# EAGLE design led strip v3 (EAGLE 8.4.3)
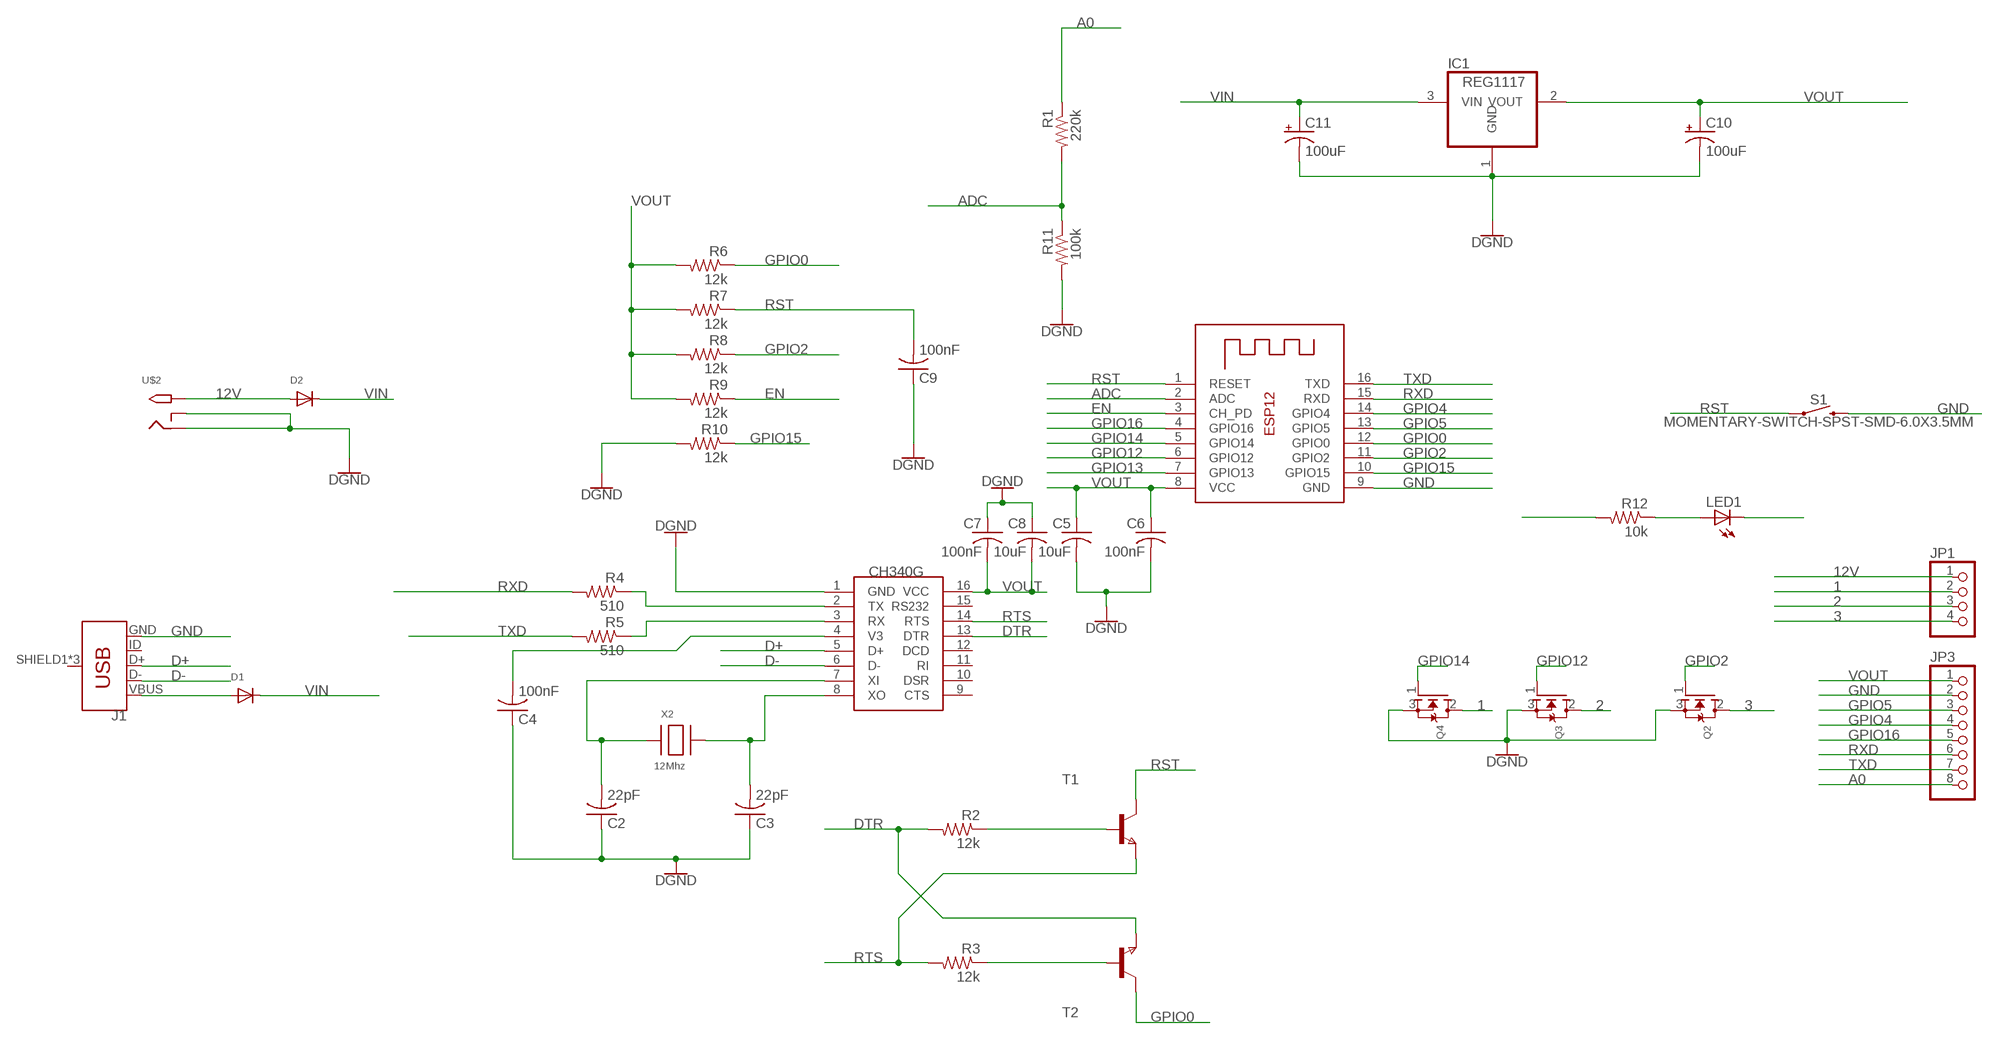
[diagram p0: schematic, sheet 1]

## Parts
C2  22pF  C-USC0805  [C0805]
C3  22pF  C-USC0805  [C0805]
C4  100nF  C-USC0805  [C0805]
C5  10uF  C-USC0805  [C0805]
C6  100nF  C-USC0805  [C0805]
C7  100nF  C-USC0805  [C0805]
C8  10uF  C-USC0805  [C0805]
C9  100nF  C-USC0805  [C0805]
C10  100uF  CPOL-USCT7343  [CT7343]
C11  100uF  CPOL-USCT7343  [CT7343]
D1  DIODESOD-123  [SOD-123]
D2  DIODESOD-123  [SOD-123]
IC1  REG1117  [SOT223]
J1  USB_MICRO-B_FEMALE-SMT  [USB-B-MICRO-SMD]
JP1  PINHD-1X4  [1X04]
JP3  PINHD-1X8  [1X08]
LED1  LEDCHIP-LED0603  [CHIP-LED0603]
Q2  MOSFET-NGDS_TO220V  [TO220V]
Q3  MOSFET-NGDS_TO220V  [TO220V]
Q4  MOSFET-NGDS_TO220V  [TO220V]
R1  220k  R-US_R0805  [R0805]
R2  12k  R-US_R0805  [R0805]
R3  12k  R-US_R0805  [R0805]
R4  510  R-US_R0805  [R0805]
R5  510  R-US_R0805  [R0805]
R6  12k  R-US_R0805  [R0805]
R7  12k  R-US_R0805  [R0805]
R8  12k  R-US_R0805  [R0805]
R9  12k  R-US_R0805  [R0805]
R10  12k  R-US_R0805  [R0805]
R11  100k  R-US_R0805  [R0805]
R12  10k  R-US_R0805  [R0805]
S1  MOMENTARY-SWITCH-SPST-SMD-6.0X3.5MM  [TACTILE_SWITCH_SMD_6.0X3.5MM]
T1  NPNSOT23  [SOT-23]
T2  NPNSOT23  [SOT-23]
U$1  CH340G  [SOIC16]
U$2  2.1MMJACKTHM  [PJ-102A]
X1  ESP-12  [ESP-12]
X2  12Mhz  XTALNX5032  [NX5032]

## Nets
1: JP1.2 Q4.2(D)
2: JP1.3 Q3.2(D)
3: JP1.4 Q2.2(D)
12V: D2.A JP1.1 U$2.TIP
A0: JP3.8 R1.1
ADC: R1.2 R11.1 X1.2(ADC)
D+: J1.D+ U$1.5(D+)
D-: J1.D- U$1.6(D-)
DTR: R2.2 T2.2(E) U$1.13(DTR)
EN: R9.1 X1.3(CH_PD)
GND: C2.1 C3.1 C4.1 C5.2 C6.2 C7.1 C8.1 C9.1 C10.- C11.- IC1.1(GND) J1.GND JP3.2 LED1.C Q2.3(S) Q3.3(S) Q4.3(S) R10.2 R11.2 S1.2 U$1.1(GND) U$2.RING U$2.RING_SW X1.9(GND) ; supply symbol labelled DGND
GPIO0: R6.1 T2.1(C) X1.12(GPIO0)
GPIO2: Q2.1(G) R8.1 X1.11(GPIO2)
GPIO4: JP3.4 X1.14(GPIO4)
GPIO5: JP3.3 X1.13(GPIO5)
GPIO12: Q3.1(G) X1.6(GPIO12)
GPIO13: X1.7(GPIO13)
GPIO14: Q4.1(G) X1.5(GPIO14)
GPIO15: R10.1 X1.10(GPIO15)
GPIO16: JP3.5 X1.4(GPIO16)
N$1: R2.1 T1.3(B)
N$2: R3.1 T2.3(B)
N$3: D1.A J1.VBUS
N$4: LED1.A R12.1
N$5: C2.2 U$1.7(XI) X2.P$1
N$6: C3.2 U$1.8(XO) X2.P$2
N$28: R4.1 U$1.2(TX)
N$29: R5.1 U$1.3(RX)
N$30: C4.2 U$1.4(V3)
RST: C9.2 R7.1 S1.1 T1.1(C) X1.1(RESET)
RTS: R3.2 T1.2(E) U$1.14(RTS)
RXD: JP3.6 R4.2 X1.15(RXD)
TXD: JP3.7 R5.2 X1.16(TXD)
VIN: C11.+ D1.C D2.C IC1.3(VIN)
VOUT: C5.1 C6.1 C7.2 C8.2 C10.+ IC1.2(VOUT) JP3.1 R6.2 R7.2 R8.2 R9.2 R12.2 U$1.16(VCC) X1.8(VCC)
Unconnected: J1.ID J1.SHIELD1(SHIELD) J1.SHIELD2(SHIELD) J1.SHIELD3(SHIELD) U$1.9(CTS) U$1.10(DSR) U$1.11(RI) U$1.12(DCD) U$1.15(RS232)

## Library data of the parts
C2-C9 = adafruit:C-US: CAPACITOR, American symbol
C10 C11 = adafruit:CPOL-US: POLARIZED CAPACITOR, American symbol
D1 D2 = adafruit:DIODE: Diode SMADIODE - SMA Surface Mount Package 20V 1A Schottky Diode Digikey: 641-1014-6-ND DO-1N4148 - Through Hole Small Current Diode SOD-123 20V 1 A (.5mV Vf) Schottky Diode - Digikey: MBRX120TPMSCT-ND SOD-323 10V 570mA (.38mV Vf, 3ns) Schottky Diode - Digikey: ZLLS410CT-ND SOD-523 30V 30mA Schottky Diode (RB751S-40TE61) - Digikey: RB751S-40TE61CT-ND SOT23-R/W - SOT23 Package (R = Solder Paste/Reflow Ovens, W = Hand-Soldering) BAT54Film 40V 300mA - Digikey: 497-7162-1-ND
IC1 = burr-brown:REG1117: 800mA and 1A Low Dropout (LDO) Positive Regulator 1.8V, 2.5V, 2.85V, 3.3V, 5V, and Adj; MPN: REG1117; OC_FARNELL: 1097566; OC_NEWARK: 14P6981
J1 = SparkFun-Connectors:USB_MICRO-B: USB Type Micro-B Connector Male/female and PTH/SMT variants SparkFun Products: SparkFun microB USB Breakout <https://www.sparkfun.com/products/12035> SparkFun USB microB Plug Breakout <https://www.sparkfun.com/products/10031> SparkFun ESP8266 Thing <https://www.sparkfun.com/products/13231>; PROD_ID: CONN-11752
JP1 = pinhead:PINHD-1X4: PIN HEADER
JP3 = pinhead:PINHD-1X8: PIN HEADER
LED1 = adafruit:LED: LED OSRAM: - CHIPLED LG R971, LG N971, LY N971, LG Q971, LY Q971, LO R971, LY R971 LH N974, LH R974 LS Q976, LO Q976, LY Q976 LO Q996 - Hyper CHIPLED LW Q18S LB Q993, LB Q99A, LB R99A - SideLED LS A670, LO A670, LY A670, LG A670, LP A670 LB A673, LV A673, LT A673, LW A673 LH A674 LY A675 LS A676, LA A676, LO A676, LY A676, LW A676 LS A679, LY A679, LG A679 - Hyper Micro SIDELED® LS Y876, LA Y876, LO Y876, LY Y876 LT Y87S - SmartLED LW L88C, LW L88S LB L89C, LB L89S, LG L890 LS L89K, LO L89K, LY L89K LS L896, LA L896, LO L896, LY L896 - TOPLED LS T670, LO T670, LY T670, LG T670, LP T670 LSG T670, LSP T670, LSY T670, LOP T670, LYG T670 LG T671, LOG T671, LSG T671 LB T673, LV T673, LT T673, LW T673 LH T674 LS T676, LA T676, LO T676, LY T676, LB T676, LH T676, LSB T676, LW T676 LB T67C, LV T67C, LT T67C, LS T67K, LO T67K, LY T67K, LW E67C LS E67B, LA E67B, LO E67B, LY E67B, LB E67C, LV E67C, LT E67C LW T67C LS T679, LY T679, LG T679 LS T770, LO T770, LY T770, LG T770, LP T770 LB T773, LV T773, LT T773, LW T773 LH T774 LS E675, LA E675, LY E675, LS T675 LS T776, LA T776, LO T776, LY T776, LB T776 LHGB T686 LT T68C, LB T68C - Hyper Mini TOPLED® LB M676 - Mini TOPLED Santana® LG M470 LS M47K, LO M47K, LY M47K Source: http://www.osram.convergy.de/
Q2-Q4 = adafruit:MOSFET-N: N-Channel Mosfet 2N7002E - 60V 260mA SOT23 [Digikey: 2N7002ET1GOSTR-ND] - REEL BSH103 - 30V 850mA SOT23 [Digikey: 568-5013-1-ND]
R1-R12 = adafruit:R-US_: RESISTOR, American symbol
S1 = SparkFun-Switches:MOMENTARY-SWITCH-SPST: Momentary Switch (Pushbutton) - SPST Normally-open (NO) SPST momentary switches (buttons, pushbuttons). Variants PTH-12MM - 12mm square, through-hole Momentary Pushbutton Switch - 12mm Square <https://www.sparkfun.com/products/9190> (COM-09190) PTH-6.0MM, PTH-6.0MM-KIT - 6.0mm square, through-hole Mini Pushbutton Switch <https://www.sparkfun.com/products/97> (COM-00097) KIT package intended for soldering kit's - only one side of pads' copper is exposed. PTH-RIGHT-ANGLE-KIT - Right-angle, through-hole Right Angle Tactile Button <https://www.sparkfun.com/products/10791> - Used on SparkFun BigTime Watch Kit <https://www.sparkfun.com/products/11734> SMD-12MM - 12mm square, surface-mount Tactile Button - SMD (12mm) <https://www.sparkfun.com/products/12993> (COM-12993) Used on SparkFun PicoBoard <https://www.sparkfun.com/products/11888> SMD-4.5MM - 4.5mm Square Trackball Switch Used on SparkFun Blackberry Trackballer Breakout <https://www.sparkfun.com/products/13169> SMD-4.6MMX2.8MM - 4.60mm x 2.80mm, surface mount Used on SparkFun SAMD21 Mini Breakout <https://www.sparkfun.com/products/13664> SMD-5.2MM, SMD-5.2-REDUNDANT - 5.2mm square, surface-mount Mini Pushbutton Switch - SMD <https://www.sparkfun.com/products/8720> (COM-08720) Used on Arduino Pro Mini <https://www.sparkfun.com/products/11114> REDUNDANT package connects both switch circuits together SMD-6.0X3.5MM - 6.0 x 3.5mm, surface mount Momentary Reset Switch SMD <https://www.sparkfun.com/products/8229> (COM-08229) SMD-6.2MM-TALL - 6.2mm square, surface mount Tactile Button - SMD (6mm) <https://www.sparkfun.com/products/12992> Used on SparkFun Digital Sandbox <https://www.sparkfun.com/products/12651> SMD-RIGHT-ANGLE - Right-angle, surface mount Used on SparkFun Block for Intel® Edison - Arduino <https://www.sparkfun.com/products/13036>; PROD_ID: SWCH-00815; SF_SKU: COM-08229
T1 T2 = zetex:NPNSOT23: NPN TRANSISTOR; MPN: DSS20201L-7; OC_FARNELL: 1710688; OC_NEWARK: 25R4555
U$1 = ch340g:CH340G
U$2 = adafruit:2.1MMJACK: 2.1mm x 5.5mm THM DC jack with internal switch. Digikey part #PJ-102A, 4UCON part #05537 2.1mm x 5.5mm SMT DC jack with internal switch. Digikey part #PJ-002A-SMT, 4UCON part #03267 By microbuilder.eu & adafruit.com
X1 = adafruit:ESP-12
X2 = adafruit:XTAL: Low cost SMT crystals, no capacitors included http://www.ladyada.net/library/eagle

## Board
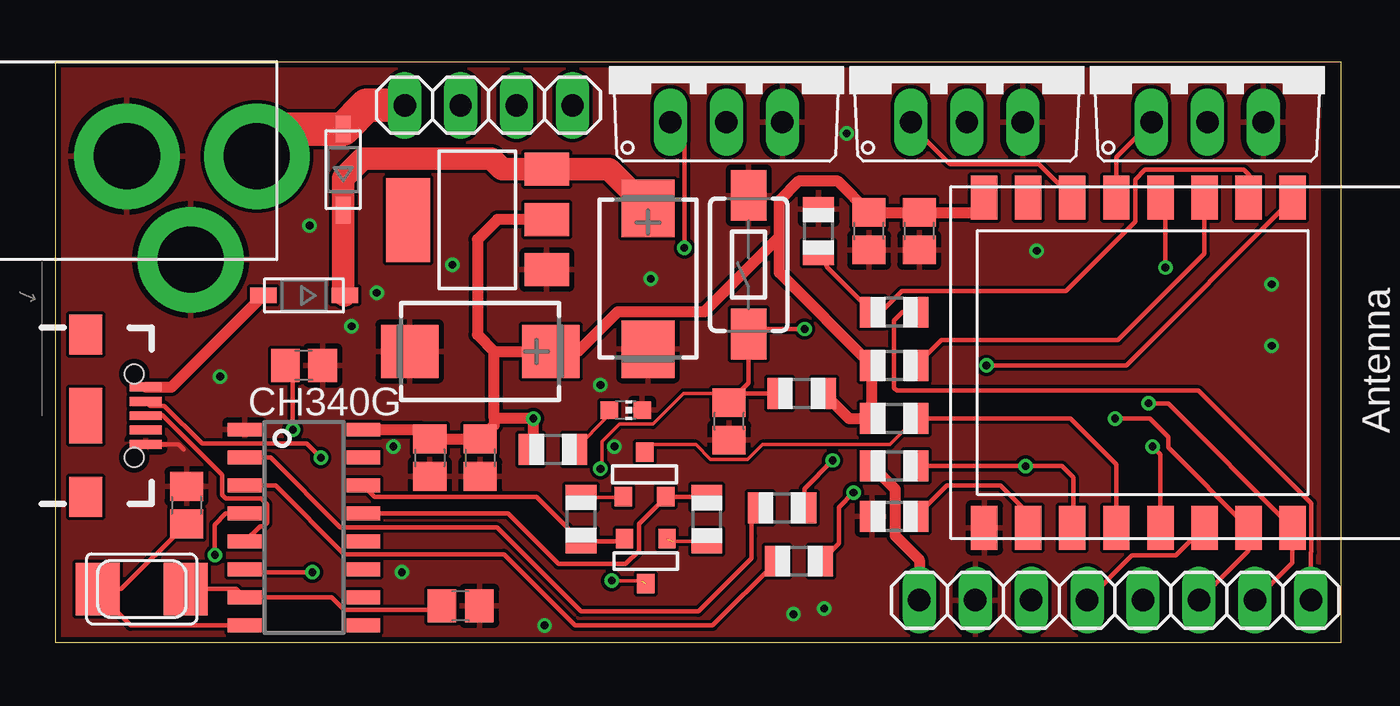
[diagram p1: board, top side]
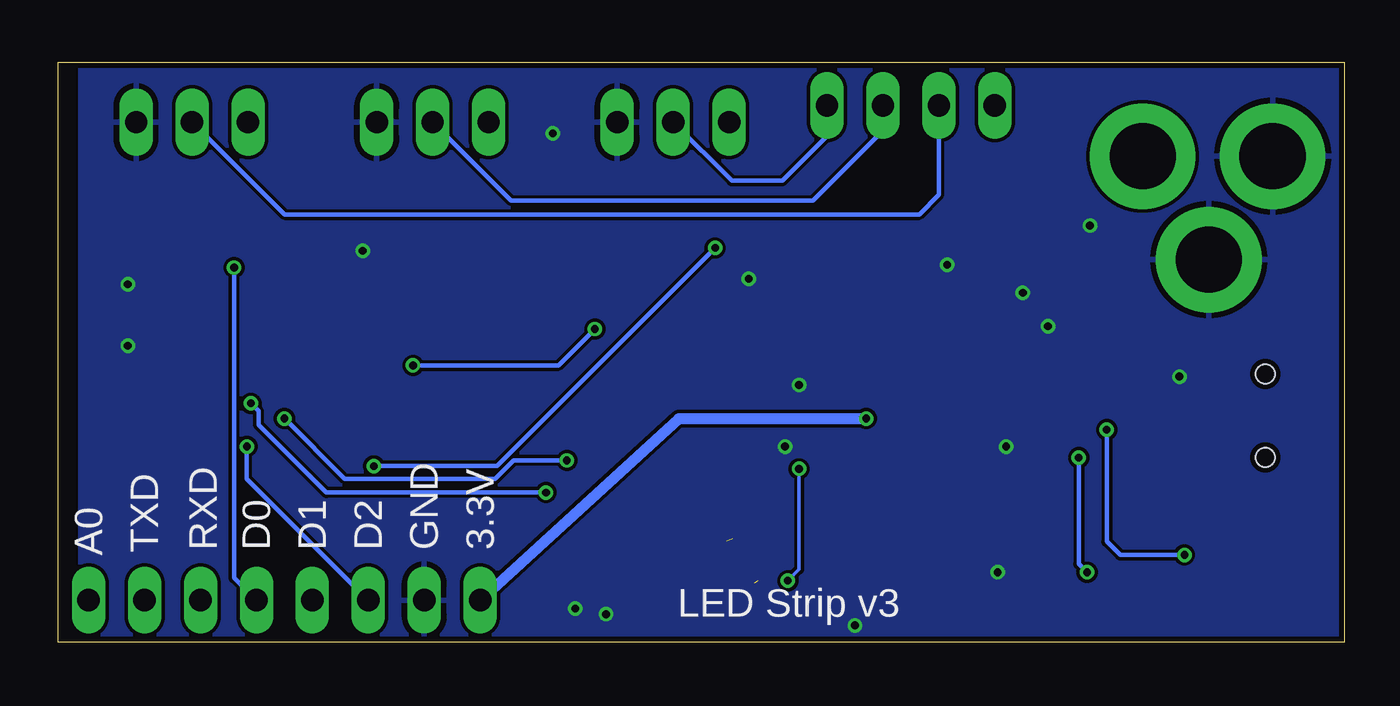
[diagram p2: board, bottom side, seen from below]

Size 58.4 x 26.34 mm. Coordinates in mm from the lower left corner, seen from the top.
Outline: 0,0 58.4,0 58.4,26.34 0,26.34 0,0
Copper layers (1*16): Top 0.035mm / dielectric 1.5mm / Bottom 0.035mm
Design rules "SeeedStudio_2layer_DRU_no_angle_20140221": minimum track width 6mil, minimum drill 12mil, track to track 6mil, track to pad 6mil, pad to pad 6mil, via to via 6mil, smd to smd 0mil, copper to edge 10mil, drill to drill 10mil, minimum pad ring 10mil, minimum via ring 6mil, stop-mask expansion 2mil, vias tented up to drill 100mil, thermal gap 10mil

### Footprints (pad centres in the part's own frame; a part is rotated, then mirrored left to right if it is on the bottom)
C0805 = smd 1.3 x 1.5: 1 -0.85,0; 2 0.85,0
CT7343 = smd 2.6 x 2.4: + 3.2,0; - -3.2,0
SOD-123 = smd 1.2 x 0.7: A 1.85,0; C -1.85,0
SOT223 = smd 1.499 x 2.007: 1 -2.261,-3.15; 2 0.025,-3.15; 3 2.311,-3.15 | smd 3.81 x 2.007: 4 0,3.15
USB-B-MICRO-SMD = smd 1.45 x 0.4: D+ 2.725,0; D- 2.725,0.65; GND 2.725,-1.3; ID 2.725,-0.65; VBUS 2.725,1.3 | smd 1.5 x 1.8: SHIELD1 0,3.685; SHIELD2 0,-3.685 | smd 1.5 x 2.5: SHIELD3 0,0 | hole 0.85: 2.2,1.9; 2.2,-1.9
1X04 = drill 1.016 long: 1 -3.81,0; 2 -1.27,0; 3 1.27,0; 4 3.81,0
1X08 = drill 1.016 long: 1 -8.89,0; 2 -6.35,0; 3 -3.81,0; 4 -1.27,0; 5 1.27,0; 6 3.81,0; 7 6.35,0; 8 8.89,0
CHIP-LED0603 = smd 0.8 x 0.8: A 0,-0.75; C 0,0.75
TO220V = drill 1.016 long: 1 -2.54,-2.54; 2 0,-2.54; 3 2.54,-2.54
R0805 = smd 1.1 x 1.4: 1 -1,0; 2 1,0
TACTILE_SWITCH_SMD_6.0X3.5MM = smd 2.3 x 1.6: 1 -3.15,0; 2 3.15,0
SOT-23 = smd 0.787 x 0.889: 1 0.025,-1.016; 2 -0.94,1.016; 3 0.991,1.016
SOIC16 = smd 0.635 x 1.524: 1 -4.445,-2.695; 2 -3.175,-2.695; 3 -1.905,-2.695; 4 -0.635,-2.695; 5 0.635,-2.695; 6 1.905,-2.695; 7 3.175,-2.695; 8 4.445,-2.695; 9 4.445,2.695; 10 3.175,2.695; 11 1.905,2.695; 12 0.635,2.695; 13 -0.635,2.695; 14 -1.905,2.695; 15 -3.175,2.695; 16 -4.445,2.695
PJ-102A = drill 3 pad 4.8: RING 0.1,-3.39; RING_SW -4.6,-6.29; TIP 0.1,-9.29
ESP-12 = smd 2 x 1.2: 1 -7.5,4.5; 2 -7.5,2.5; 3 -7.5,0.5; 4 -7.5,-1.5; 5 -7.5,-3.5; 6 -7.5,-5.5; 7 -7.5,-7.5; 8 -7.5,-9.5; 9 7.5,-9.5; 10 7.5,-7.5; 11 7.5,-5.5; 12 7.5,-3.5; 13 7.5,-1.5; 14 7.5,0.5; 15 7.5,2.5; 16 7.5,4.5
NX5032 = smd 2 x 2.4: P$1 2,0; P$2 -2,0

### Placement (x,y rotation side)
C2  18.41,1.65 180 top
C3  5.97,6.22 270 top
C4  11.3,12.57 180 top
C5  19.3,8.38 270 top
C6  17.02,8.38 270 top
C7  39.24,18.67 90 top
C8  36.96,18.67 90 top
C9  30.61,10.03 90 top
C10  19.3,13.21 0 top
C11  26.92,16.51 90 top
D1  11.3,15.75 180 top
D2  13.08,21.46 90 top
IC1  19.18,19.18 90 top
J1  1.4,10.29 0 top
JP1  19.68,24.38 0 top
JP3  48.13,1.91 0 top
LED1  25.91,10.54 270 top
Q2  30.48,26.16 0 top
Q3  41.4,26.16 0 top
Q4  52.32,26.16 0 top
R1  38.1,14.99 180 top
R2  29.59,5.59 90 top
R3  23.88,5.59 270 top
R4  33.02,6.1 0 top
R5  33.78,3.68 0 top
R6  38.1,10.16 180 top
R7  33.91,11.3 0 top
R8  38.1,8 180 top
R9  38.1,12.57 180 top
R10  38.1,5.71 180 top
R11  34.67,18.67 90 top
R12  22.61,8.76 180 top
S1  31.5,17.14 90 top
T1  26.8,3.68 0 top
T2  26.8,7.62 180 top
U$1  11.3,5.21 270 top
U$2  -0.13,21.97 90 top
X1  51.69,12.7 270 top
X2  3.94,2.41 0 top

### Tracks (layer width: path | path; a pad name or v marks a point on that pad's centre or on a via)
1
  Bottom 0.203: Q4.2 48.13,19.43 19.3,19.43 18.41,20.32 JP1.2
2
  Bottom 0.203: Q3.2 37.85,20.07 24.13,20.07 20.95,23.24 JP1.3
3
  Bottom 0.203: Q2.2 27.81,20.95 25.53,20.95 23.5,22.99 JP1.4
12V
  Top 1.524: U$2.TIP 10.4,23.31 D2.A 14.15,24.38 JP1.1
A0
  Top 0.203: JP3.8 57.02,4.08 57.04,4.09 57.04,6.3 51.92,11.43 38.23,11.43 38.1,11.56 38.1,14.61 38.48,14.99 R1.1
ADC
  Top 0.203: R11.1 35.05,17.03 R1.2 37.49,14.99 38.45,15.94 45.89,15.94 49.04,19.09 49.04,21.01 49.48,21.45 53.98,21.45 54.23,21.21 54.23,20.24 X1.2
D+
  Top 0.203: U$1.5 9.31,5.27 9.47,5.27 9.62,5.42 9.62,6.26 9.35,6.54 7.74,6.54 7.59,6.69 7.59,7.6 4.87,10.33 4.16,10.33 J1.D+
D-  (via drill 0.35)
  Top 0.203: J1.D- 4.32,10.74 4.95,10.74 6.68,9.02 11.43,9.02 v12.06,8.38 | v11.68,3.17 8.73,3.17 U$1.6
  Bottom 0.203: v11.68,3.17 12.06,3.56 v12.06,8.38
DTR
  Top 0.203: U$1.13 20.57,5.84 22.86,3.56 25.91,3.56 26.5,4.15 26.5,5.37 T2.2 29.57,6.6 R2.2
EN
  Top 0.203: R9.1 40.24,13.72 48.26,13.72 52.19,17.64 X1.3
GND  (via drill 0.35)
  Top 0.203: J1.GND 5.62,8.99 5.84,8.76
  other vias: 13.46,14.35 15.37,8.89 15.75,3.17 33.53,1.27 22.23,0.76 24.77,11.68 25.4,8.89 27.05,16.51 14.61,15.88 55.24,16.26 55.24,13.46 34.92,1.52 18.03,17.14 7.49,12.06 11.56,18.92 35.94,23.11 44.58,17.78
  pour Bottom: -8.38,31.5 57.4,31.5 57.4,-2.03 -8.38,-2.03 -8.38,31.37
  pour Top: -1.78,-0.51 -1.78,27.81 57.4,27.81 57.4,-1.4 -1.78,-1.4
GPIO0
  Top 0.152: R6.1 37.91,8.97 32.12,8.97 31.45,8.3 29.76,8.3 29.09,8.97 27.11,8.97 T2.1
  Top 0.203: R6.1 46.1,10.16 48.19,8.07 X1.12
GPIO2  (via drill 0.35)
  Top 0.203: X1.11 46.23,5.24 46.23,7.49 45.72,8 v44.07,8 R8.1 | Q2.1 28.57,22.99 v28.57,17.91
  Bottom 0.203: v28.57,17.91 38.48,8 v44.07,8
GPIO4
  Top 0.203: JP3.4 48.9,3.95 50.89,3.95 52.15,5.2 X1.14
GPIO5  (via drill 0.35)
  Top 0.203: v49.84,8.89 50.19,8.54 X1.13
  Bottom 0.203: JP3.3 49.84,7.42 v49.84,8.89
GPIO12
  Top 0.203: X1.6 44.67,21.72 40.64,21.72 38.86,23.5 Q3.1
GPIO14
  Top 0.203: X1.5 48.19,22.03 Q4.1
GPIO15
  Top 0.203: R10.1 40.5,7.11 42.93,7.11 44.19,5.85 X1.10
GPIO16  (via drill 0.35)
  Top 0.203: v50.42,17.02 50.42,19.97 X1.4
  Bottom 0.203: JP3.5 50.42,2.92 v50.42,17.02
N$1  (1 unrouted)
  Top 0.152: R2.1 28.07,4.59
N$2
  Top 0.152: T2.3 25.79,6.59 R3.1
N$3
  Top 0.508: J1.VBUS 5.29,11.59 D1.A
N$4
  Top 0.152: R12.1 25.16,10.31 LED1.A
N$5
  Top 0.203: X2.P$1 8.23,2.41 U$1.7 12.56,2.03 13.13,1.46 14.87,1.46 17.38,1.46 C2.2
N$6
  Top 0.203: 2.03,2.41 X2.P$2 | 2.03,2.41 3.01,2.41 C3.2 | U$1.8 3.43,0.76 2.03,2.16 2.03,2.41
N$28
  Top 0.152: 31.62,5.7 R4.1
  Top 0.203: U$1.2 9.78,8.38 12.95,5.21 20.07,5.21 23.88,1.4 29.21,1.4 31.62,3.81 31.62,4.81 31.62,5.7
N$29
  Top 0.203: U$1.3 10.02,7.11 13.13,4 20.38,4 23.62,0.76 29.86,0.76 R5.1
N$30  (via drill 0.35)
  Top 0.203: C4.2 10.79,12.23 v10.79,9.65 | v7.26,3.96 7.24,3.99 7.24,5.33 7.75,5.84 U$1.4
  Bottom 0.203: v10.79,9.65 10.79,4.57 10.19,3.96 v7.26,3.96
RST  (via drill 0.35)  (1 unrouted)
  Top 0.152: v24.77,7.87 24.84,7.95 24.84,9.12 25.63,9.9 27.14,9.9 28.54,11.3 R7.1 | v25.27,2.79 26.63,2.79
  Top 0.203: X1.1 56.19,20.12 48.64,12.57 v42.29,12.57 | v34.04,14.22 32,14.22 31.67,14.55 S1.1 31.5,11.77 C9.2 31.03,11.3 R7.1
  Bottom 0.152: v24.77,7.87 24.77,3.3 v25.27,2.79
  Bottom 0.203: v42.29,12.57 35.69,12.57 v34.04,14.22
RTS
  Top 0.203: T1.2 25.75,4.59 R3.2 21.86,6.6 14.51,6.6 U$1.14
RXD  (via drill 0.35)
  Top 0.203: JP3.6 54.19,4.15 X1.15 50.55,8.84 50.55,9.33 49.72,10.16 v48.13,10.16 | R4.2 34.02,6.97 v35.31,8.26
  Bottom 0.203: v48.13,10.16 45.39,7.42 38.56,7.42 37.72,8.26 v35.31,8.26
TXD  (via drill 0.35)
  Top 0.203: JP3.7 56.19,3.61 X1.16 50.54,10.85 v49.66,10.85 | v36.26,6.8 35.59,6.13 35.59,4.49 R5.2
  Bottom 0.203: v36.26,6.8 46.23,6.8 49.31,9.87 49.31,10.5 v49.66,10.85
VIN
  Top 1.016: D1.C 13.08,15.82 D2.C 13.08,21.08 13.97,21.97 19.81,21.97 20.3,21.49 IC1.3 25.15,21.49 C11.+
VOUT  (via drill 0.35)
  Top 0.508: IC1.2 20.09,19.2 19.18,18.29 19.18,13.97 19.94,13.21 | 19.94,13.21 C10.+ 23.75,13.21 25.56,15.02 29.49,15.02 32.89,18.41 | 19.94,10.16 19.94,9.87 C5.1 C6.1 16.6,9.65 U$1.16 | 19.94,10.16 19.94,13.21 | R6.2 R9.2 32.89,16.78 32.89,18.41 | 19.94,10.16 v21.72,10.16 21.72,8.87 R12.2 | R8.2 38.14,6.96 38.14,4.85 39.24,3.75 JP3.1 | 32.89,18.41 32.89,20.07 33.78,20.95 35.52,20.95 C8.2 C7.2 42.12,19.52 42.19,19.58 X1.8 | R6.2 36.97,10.29 | R7.2 36.05,10.16 R6.2
  Bottom 0.508: JP3.1 30.23,10.16 v21.72,10.16

### Text on the board
bPlace: 3.3V | GND | D2 | D1 | D0 | RXD | TXD | A0 | LED Strip v3